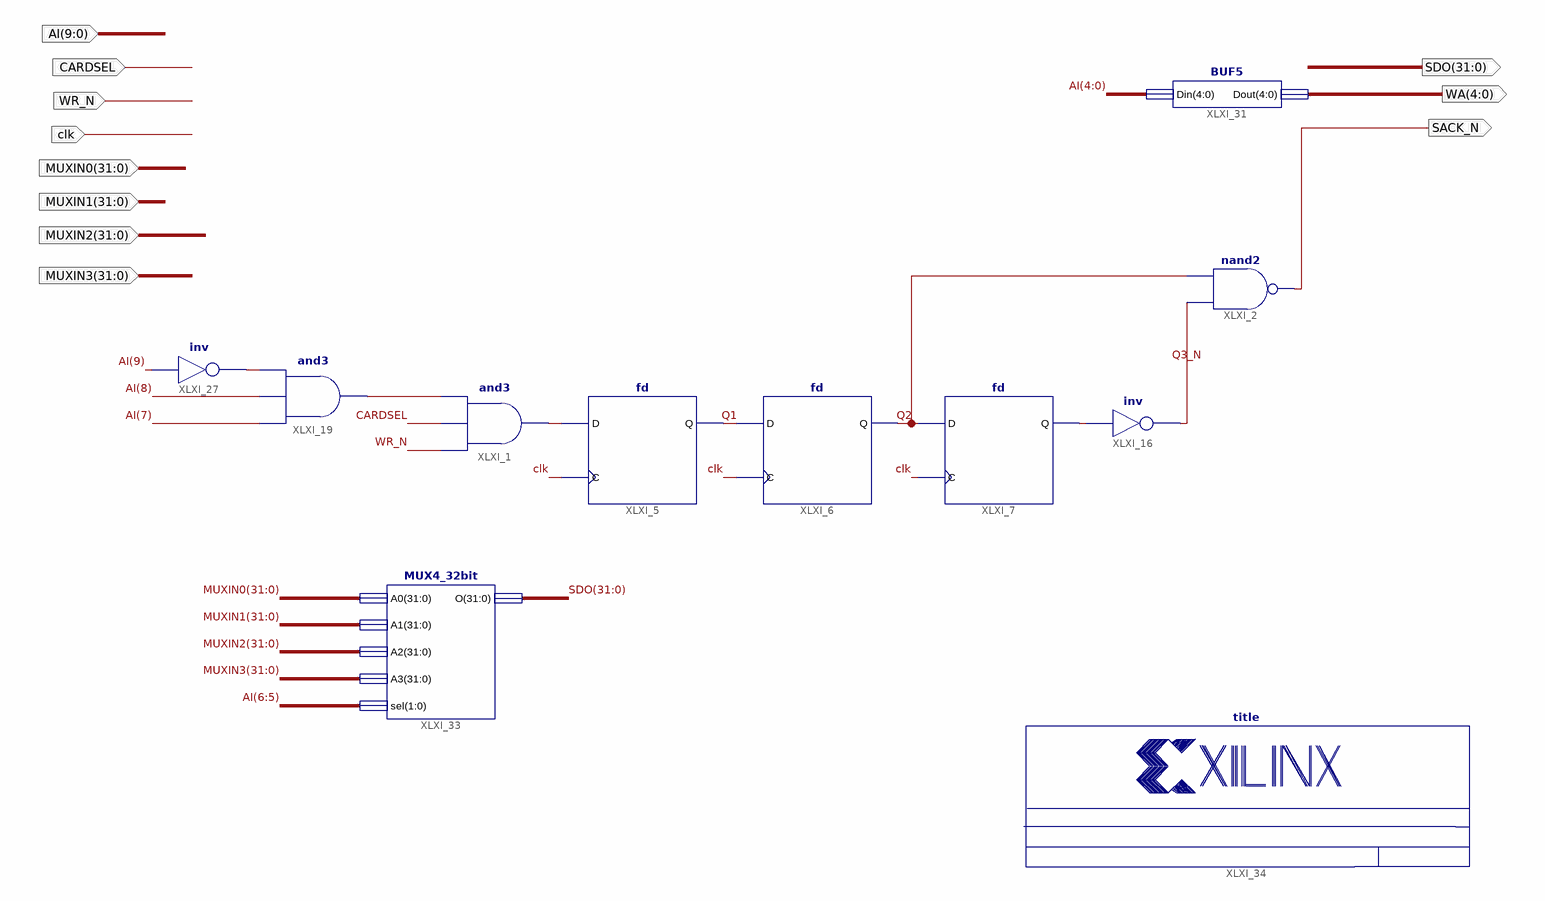
[diagram p0: schematic sheet 1]
// Xilinx ISE schematic slave_scheme.sch (spartan6) as structural Verilog: 11 symbols, 11 ports
module slave_scheme (
  input  [9:0] AI,
  input  CARDSEL,
  input  WR_N,
  input  clk,
  input  [31:0] MUXIN0,
  input  [31:0] MUXIN2,
  input  [31:0] MUXIN3,
  input  [31:0] MUXIN1,
  output SACK_N,
  output [4:0] WA,
  output [31:0] SDO
);

  wire outand1, Q1, Q2, Q3, Q3_N, XLXN_16, XLXN_67;

  not XLXI_27 (XLXN_67, AI[9]);
  and XLXI_19 (outand1, AI[7], AI[8], XLXN_67);
  nand XLXI_2 (SACK_N, Q3_N, Q2);
  not XLXI_16 (Q3_N, Q3);
  fd XLXI_7 (.C(clk), .D(Q2), .Q(Q3));
  fd XLXI_6 (.C(clk), .D(Q1), .Q(Q2));
  fd XLXI_5 (.C(clk), .D(XLXN_16), .Q(Q1));
  and XLXI_1 (XLXN_16, WR_N, CARDSEL, outand1);
  BUF5 XLXI_31 (.Din(AI[4:0]), .Dout(WA));
  MUX4_32bit XLXI_33 (.A0(MUXIN0), .A1(MUXIN1), .A2(MUXIN2), .A3(MUXIN3), .sel(AI[6:5]), .O(SDO));
  title #(.TitleFieldText("Lab 3 - Slave"), .NameFieldText(": Reaal_Abuhoof_208866145_Nizar_Khalaila_212683932")) XLXI_34 ();
endmodule
